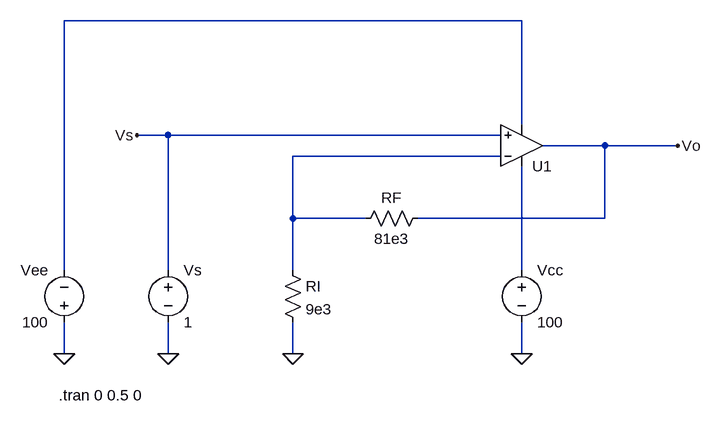
[diagram p0: schematic exercise2.asc]
exercise2.asc, the LTspice schematic file:
Version 4
SHEET 1 880 680
WIRE 432 -144 -272 -144
WIRE 432 16 432 -144
WIRE -112 32 -160 32
WIRE 400 32 -112 32
WIRE 560 48 464 48
WIRE 672 48 560 48
WIRE 400 64 80 64
WIRE 80 160 80 64
WIRE 192 160 80 160
WIRE 560 160 560 48
WIRE 560 160 272 160
WIRE -272 240 -272 -144
WIRE -112 240 -112 32
WIRE 80 240 80 160
WIRE 432 240 432 80
WIRE -272 368 -272 320
WIRE -112 368 -112 320
WIRE 80 368 80 320
WIRE 432 368 432 320
FLAG 80 368 0
FLAG 672 48 Vo
FLAG 432 368 0
FLAG -272 368 0
FLAG -112 368 0
FLAG -160 32 Vs
SYMBOL OpAmps\\UniversalOpAmp2 432 48 M180
SYMATTR InstName U1
SYMATTR Value2 Avol=100 GBW=10Meg Slew=10Meg
SYMBOL res 64 224 R0
SYMATTR InstName RI
SYMATTR Value 9e3
SYMBOL res 288 144 R90
WINDOW 0 0 56 VBottom 2
WINDOW 3 32 56 VTop 2
SYMATTR InstName RF
SYMATTR Value 81e3
SYMBOL voltage -112 224 R0
WINDOW 123 0 0 Left 0
WINDOW 39 0 0 Left 0
SYMATTR InstName Vs
SYMATTR Value 1
SYMBOL voltage 432 224 R0
WINDOW 123 0 0 Left 0
WINDOW 39 0 0 Left 0
SYMATTR InstName Vcc
SYMATTR Value 100
SYMBOL voltage -272 336 R180
WINDOW 0 24 96 Left 2
WINDOW 3 24 16 Left 2
WINDOW 123 0 0 Left 0
WINDOW 39 0 0 Left 0
SYMATTR InstName Vee
SYMATTR Value 100
TEXT -280 432 Left 2 !.tran 0 0.5 0

The netlist it stands for:
* exercise2.asc
XU1 Vs N002 N003 N001 Vo level2 Avol=100 GBW=10Meg Slew=10Meg Ilimit=25m Rail=0 Vos=0 En=0 Enk=0 In=0 Ink=0 Rin=500Meg  ; pins In+ In- V+ V- OUT
RI N002 0 9e3
RF Vo N002 81e3
Vs Vs 0 1
Vcc N003 0 100
Vee 0 N001 100
.tran 0 0.5 0
.lib UniversalOpAmp2.lib
.backanno
.end